# Altium schematic sheet CW313 20 Pin Connector.SchDoc: 20-Pin Connector
size Letter; Organization: NewAE Technology Inc.; Address1: 1083 Queen St., Suite 196; Address2: Halifax; Address3: NS; Address4: Canada B3H 0B2; SheetNumber: 4; SheetTotal: 4; SheetApproved: YES
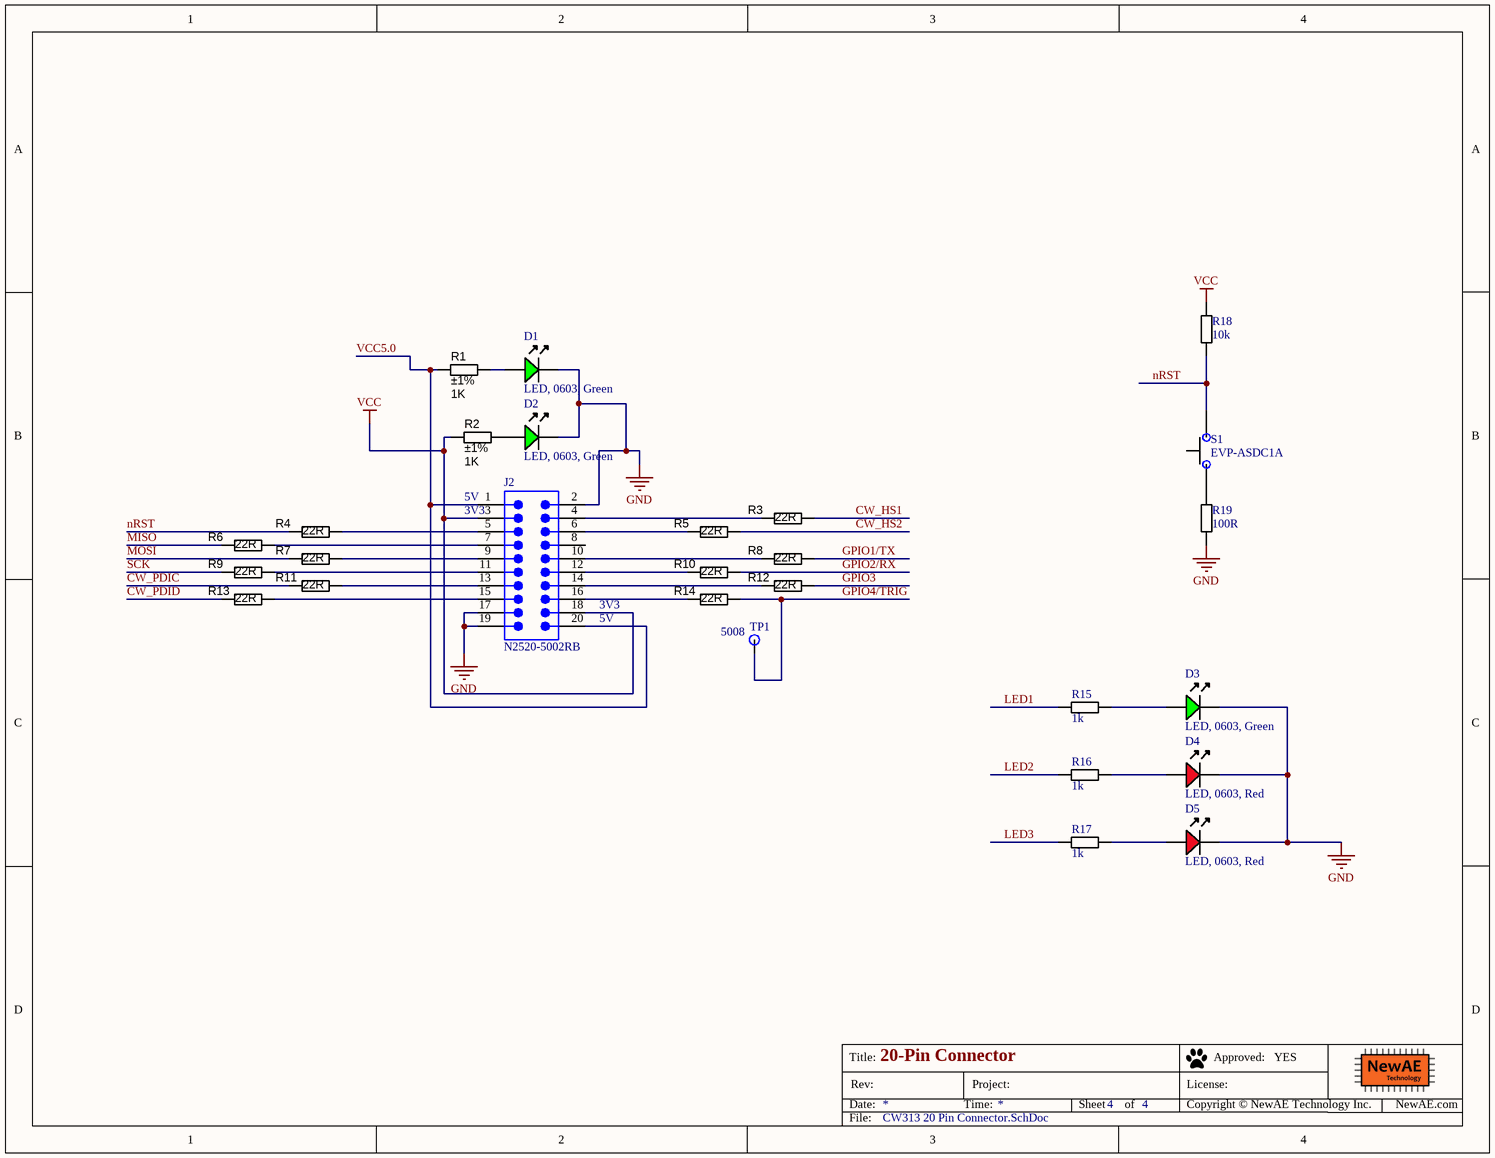
[diagram p0: CW313 20 Pin Connector.SchDoc]

## Parts
D1  LED, 0603, Green  [LED-0603-GREEN]
D2  LED, 0603, Green  [LED-0603-GREEN]
D3  LED, 0603, Green  [LED-0603-GREEN]
D4  LED, 0603, Red  [LED-0603-RED]
D5  LED, 0603, Red  [LED-0603-RED]
J2  N2520-5002RB  [NAE-PCB-CW-1000-0001-01]
R1  value 1K  Tolerance: ±1%  [RESC1608X55N]  (hidden comment: Thick Film)
R2  value 1K  Tolerance: ±1%  [RESC1608X55N]  (hidden comment: Thick Film)
R3  value 22R  [RESC1608X55N]  (hidden comment: Thick Film)
R4  value 22R  [RESC1608X55N]  (hidden comment: Thick Film)
R5  value 22R  [RESC1608X55N]  (hidden comment: Thick Film)
R6  value 22R  [RESC1608X55N]  (hidden comment: Thick Film)
R7  value 22R  [RESC1608X55N]  (hidden comment: Thick Film)
R8  value 22R  [RESC1608X55N]  (hidden comment: Thick Film)
R9  value 22R  [RESC1608X55N]  (hidden comment: Thick Film)
R10  value 22R  [RESC1608X55N]  (hidden comment: Thick Film)
R11  value 22R  [RESC1608X55N]  (hidden comment: Thick Film)
R12  value 22R  [RESC1608X55N]  (hidden comment: Thick Film)
R13  value 22R  [RESC1608X55N]  (hidden comment: Thick Film)
R14  value 22R  [RESC1608X55N]  (hidden comment: Thick Film)
R15  1k  [RESC1608X55N]
R16  1k  [RESC1608X55N]
R17  1k  [RESC1608X55N]
R18  10k  [RESC1608X55N]
R19  100R  [RESC1608X55N]
S1  EVP-ASDC1A  [EVPAS]
TP1  5008  [KEYSTONE5008]

## Nets
GND: D1.K D2.K D3.K D4.K D5.K J2.2 J2.17 J2.19 R19.2
VCC: J2.3 J2.18 R2.2 R18.1
CW_HS1: R3.2
CW_HS2: R5.2
CW_PDIC: R11.1
CW_PDID: R13.1
GPIO1/TX: R8.2
GPIO2/RX: R10.2
GPIO3: R12.2
GPIO4/TRIG: R14.2 TP1.1
LED1: R15.1
LED2: R16.1
LED3: R17.1
MISO: R6.1
MOSI: R7.1
nRST: R4.1 R18.2 S1.2(IN)
SCK: R9.1
VCC5.0: J2.1 J2.20 R1.2
NetD1_A: D1.A R1.1
NetD2_A: D2.A R2.1
NetD3_A: D3.A R15.2
NetD4_A: D4.A R16.2
NetD5_A: D5.A R17.2
NetJ2_4: J2.4 R3.1
NetJ2_5: J2.5 R4.2
NetJ2_6: J2.6 R5.1
NetJ2_7: J2.7 R6.2
NetJ2_9: J2.9 R7.2
NetJ2_10: J2.10 R8.1
NetJ2_11: J2.11 R9.2
NetJ2_12: J2.12 R10.1
NetJ2_13: J2.13 R11.2
NetJ2_14: J2.14 R12.1
NetJ2_15: J2.15 R13.2
NetJ2_16: J2.16 R14.1
NetR19_1: R19.1 S1.1(IN)

Not connected (* = marked no-connect by the designer): J2 8

## Notes on the sheet
- (near J2) 5V
- (near J2) 3V3
- Title:
- Date:
- Rev:
- Time:
- Project:
- Sheet
- of
- License:
- Copyright © NewAE Technology Inc.
- Approved:
- NewAE.com
- File:

## Library data of the parts
D1-D3 = LEDCHIP_0603_GREEN: Chip LED, Green; Manufacture 1: Kingbright; Manufacture Part Number 1: APT1608CGCK; Component Group: Optical; PP Material Stack: 16; PP Rotation: -90; Part Number: LEDCHIP_0603_GREEN; Pin Count: 2; Supplier 1: Digi-Key; Supplier Part Number 1: 754-1116-1-ND; Mounting Technology: SMT; Component Kind: Standard; Component Type: Standard
D4 D5 = LEDCHIP_0603_RED: Chip LED, Red; Manufacture 1: Kingbright; Manufacture Part Number 1: APT1608SRCPRV; Component Group: Optical; PP Material Stack: 15; PP Rotation: -90; Part Number: LEDCHIP_0603_RED; Pin Count: 2; Supplier 1: Digi-Key; Supplier Part Number 1: 754-1122-1-ND; Mounting Technology: SMT; Component Kind: Standard; Component Type: Standard
J2 = NAE-CW-1000-0001-01: 20 Pin R/A Shrouded Header; Manufacturer: 3M; Pitch: 2.54 mm; PackageReference: N2520-5002RB; PackageDescription: .100[2.54] High Temp Terminal Body (Board Stacking); Orientation: Vertical; RoHS: True; Temperature Range: -55 to 125 degC; Mounting Technology: Through-hole; PartNumber: N2520-5002RB; Supplier 1: Digi-Key; Supplier Part Number 1: MHE20K-ND
R1 R2 = RES_1K_0603_1%: Resistor SMD chip 1k Ohm 0.1W 1% 0603; Manufacturer 1: Yageo; Manufacturer Part Number 1: RC0603FR-071KL; Ratings: 1/10W; SCDType: spec; Package / Case: 0603 (1608 Metric); Supplier 1: Digi-Key; Supplier Part Number 1: 311-1.00KHRCT-ND
R3-R14 = RES_22R_0603_5%: Resistor SMD chip 22 Ohm 0.1W 5% 0603; Manufacturer 1: Yageo; Manufacturer Part Number 1: RC0603JR-0722RL; Ratings: 1/10W; SCDType: spec; Temperature Coefficient: ±100ppm/°C; Tolerance: ±5%; Package / Case: 0603 (1608 metric); Case: 0603 (1608 metric); Supplier 1: Digi-Key; Supplier Part Number 1: 311-22GRCT-ND; RoHS 1: RoHS Compliant; ComponentLink1URL: http://www.yageo.com/documents/recent/PYu-RC0603_51_RoHS_L_4.pdf; ComponentLink1Description: http://www.yageo.com/documents/recent/PYu-RC0603_51_RoHS_L_4.pdf; Supplier 2: Digi-Key; Supplier Part Number 2: 1276-5022-6-ND; Manufacturer 2: Samsung Electro-Mechanics America, Inc; Manufacturer Part Number 2: RC1608J220CS; RoHS 2: RoHS Compliant; ComponentLink2URL: http://www.samsungsem.com/servlet/FileDownload?filename=productcatalog/pdf/Chip_Resistor.pdf; ComponentLink2Description: http://www.samsungsem.com/servlet/FileDownload?filename=productcatalog/pdf/Chip_Resistor.pdf; Supplier 3: Digi-Key; Supplier Part Number 3: RMCF0603JT22R0DKR-ND; Manufacturer 3: Stackpole Electronics Inc; Manufacturer Part Number 3: RMCF0603JT22R0; RoHS 3: RoHS Compliant; ComponentLink3URL: http://www.seielect.com/Catalog/SEI-RMCF_RMCP.pdf; ComponentLink3Description: http://www.seielect.com/Catalog/SEI-RMCF_RMCP.pdf; Supplier 4: Digi-Key; Supplier Part Number 4: RHM22CGDKR-ND; Manufacturer 4: Rohm Semiconductor; Manufacturer Part Number 4: MCR03ERTJ220; RoHS 4: RoHS Compliant; ComponentLink4URL: http://rohmfs.rohm.com/en/products/databook/datasheet/passive/resistor/chip_resistor/mcr_g.pdf; ComponentLink4Description: http://rohmfs.rohm.com/en/products/databook/datasheet/passive/resistor/chip_resistor/mcr_g.pdf; Supplier 5: Digi-Key; Supplier Part Number 5: P22GDKR-ND; Manufacturer 5: Panasonic Electronic Components; Manufacturer Part Number 5: ERJ-3GEYJ220V; RoHS 5: RoHS Compliant; ComponentLink5URL: http://industrial.panasonic.com/www-cgi/jvcr13pz.cgi?E+PZ+3+AOA0001+ERJ3GEYJ220V+7+WW; ComponentLink5Description: http://industrial.panasonic.com/www-cgi/jvcr13pz.cgi?E+PZ+3+AOA0001+ERJ3GEYJ220V+7+WW
R15-R17 = RCHIP-1K-0603: 1k res, 0603, 1%, 1/10W; Manufacture 1: Yageo; Manufacture Part Number 1: RC0603FR-071KL; Component Group: Resistor; Case-EIA: 0603; Case-Metric: 1608; Rated Power: 0.1W; Rated Voltage: 75VDC; Part Number: RCHIP-1K-0603; Footprint: 0603; Pin Count: 2; Supplier 1: Digi-Key; Supplier Part Number 1: 311-1.00KHRCT-ND; Value: 1k; Tolerance: 1%; Mounting Technology: SMT; Temperature Range: -55C to 155C; Component Kind: Standard; Component Type: Standard
R18 = RCHIP-10K-0603: 10k res, 0603, 1%, 1/10W; Manufacture 1: Yageo; Manufacture Part Number 1: RC0603FR-0710KL; Component Group: Resistor; Case-EIA: 0603; Case-Metric: 1608; Rated Power: 0.1W; Rated Voltage: 75VDC; Part Number: RCHIP-10K-0603; Footprint: 0603; Pin Count: 2; Supplier 1: Digi-Key; Supplier Part Number 1: 311-10.0KHRCT-ND; Value: 10k; Tolerance: 1%; Mounting Technology: SMT; Temperature Range: -55C to 155C; Component Kind: Standard; Component Type: Standard
R19 = RCHIP-100R-0603: 100R res, 0603, 1%, 1/10W; Manufacture 1: Yageo; Manufacture Part Number 1: RC0603FR-07100RL; Component Group: Resistor; Case-EIA: 0603; Case-Metric: 1608; Rated Power: 0.1W; Rated Voltage: 75VDC; Part Number: RCHIP-100R-0603; Footprint: 0603; Pin Count: 2; Supplier 1: Digi-Key; Supplier Part Number 1: 311-100HRCT-ND; Value: 100R; Tolerance: 1%; Mounting Technology: SMT; Temperature Range: -55C to 155C; Component Kind: Standard; Component Type: Standard
S1 = EVP-ASDC1A: Pushbutton, SMD, 2.5NM force, NO; Manufacture 1: Panasonic; Component Group: Switch; Rated Power: 0.1W; Rated Voltage: 75VDC; Part Number: EVP-ASDC1A; Manufacture Part Number 1: EVP-ASDC1A; Pin Count: 2; Supplier 1: Digi-Key; Supplier Part Number 1: P16856CT-ND; Mounting Technology: SMT; Component Kind: Standard; Component Type: Standard
TP1 = KEYSTONE_5008: TEST POINT PC COMPACT .063"D ORG; Part Number: KEYSTONE_5008; Component Group: Test Point; Pin Count: 1; Supplier 1: Digi-Key; Supplier Part Number 1: 36-5008-ND; Mounting Technology: Through-hole; Component Kind: Standard; Component Type: Standard